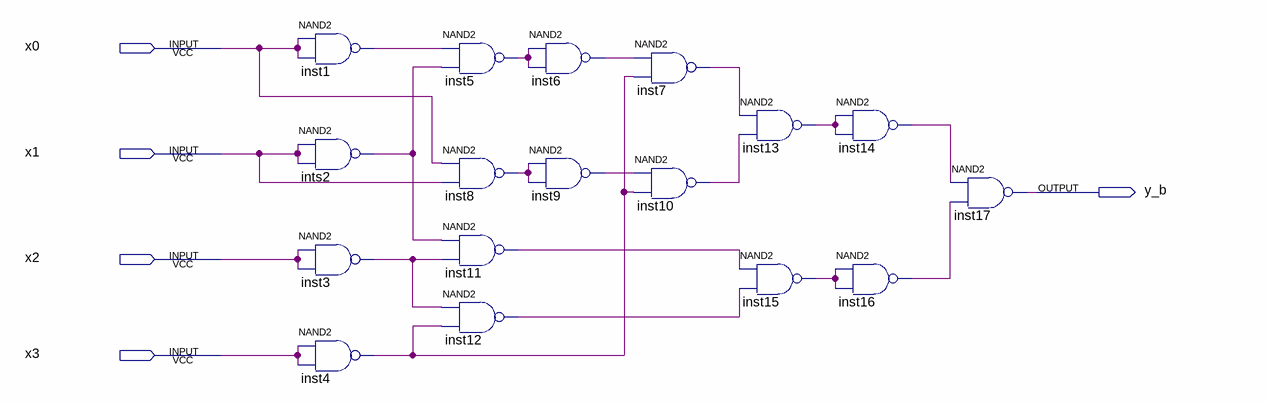
[diagram p0: schematic sheet]
// Quartus schematic y_b.bdf as structural Verilog: 17 symbols, 5 pins
module y_b (
  input  x0,
  input  x1,
  input  x2,
  input  x3,
  output y_b
);

  wire inst1_out, inst3_out, inst4_out, inst5_out, inst6_out, inst7_out, inst8_out, inst9_out, inst10_out,
       inst11_out, inst12_out, inst13_out, inst14_out, inst15_out, inst16_out, ints2_out;

  nand inst1 (inst1_out, x0, x0);
  nand ints2 (ints2_out, x1, x1);
  nand inst3 (inst3_out, x2, x2);
  nand inst4 (inst4_out, x3, x3);
  nand inst5 (inst5_out, inst1_out, ints2_out);
  nand inst8 (inst8_out, x0, x1);
  nand inst11 (inst11_out, ints2_out, inst3_out);
  nand inst12 (inst12_out, inst3_out, inst4_out);
  nand inst6 (inst6_out, inst5_out, inst5_out);
  nand inst9 (inst9_out, inst8_out, inst8_out);
  nand inst7 (inst7_out, inst6_out, inst4_out);
  nand inst10 (inst10_out, inst9_out, inst4_out);
  nand inst13 (inst13_out, inst7_out, inst10_out);
  nand inst15 (inst15_out, inst11_out, inst12_out);
  nand inst14 (inst14_out, inst13_out, inst13_out);
  nand inst16 (inst16_out, inst15_out, inst15_out);
  nand inst17 (y_b, inst14_out, inst16_out);
endmodule
